# Altium schematic sheet I2C_Mux.SchDoc: I2C Mux
size A; DocumentNumber: 22; SheetNumber: 22; SheetTotal: 22
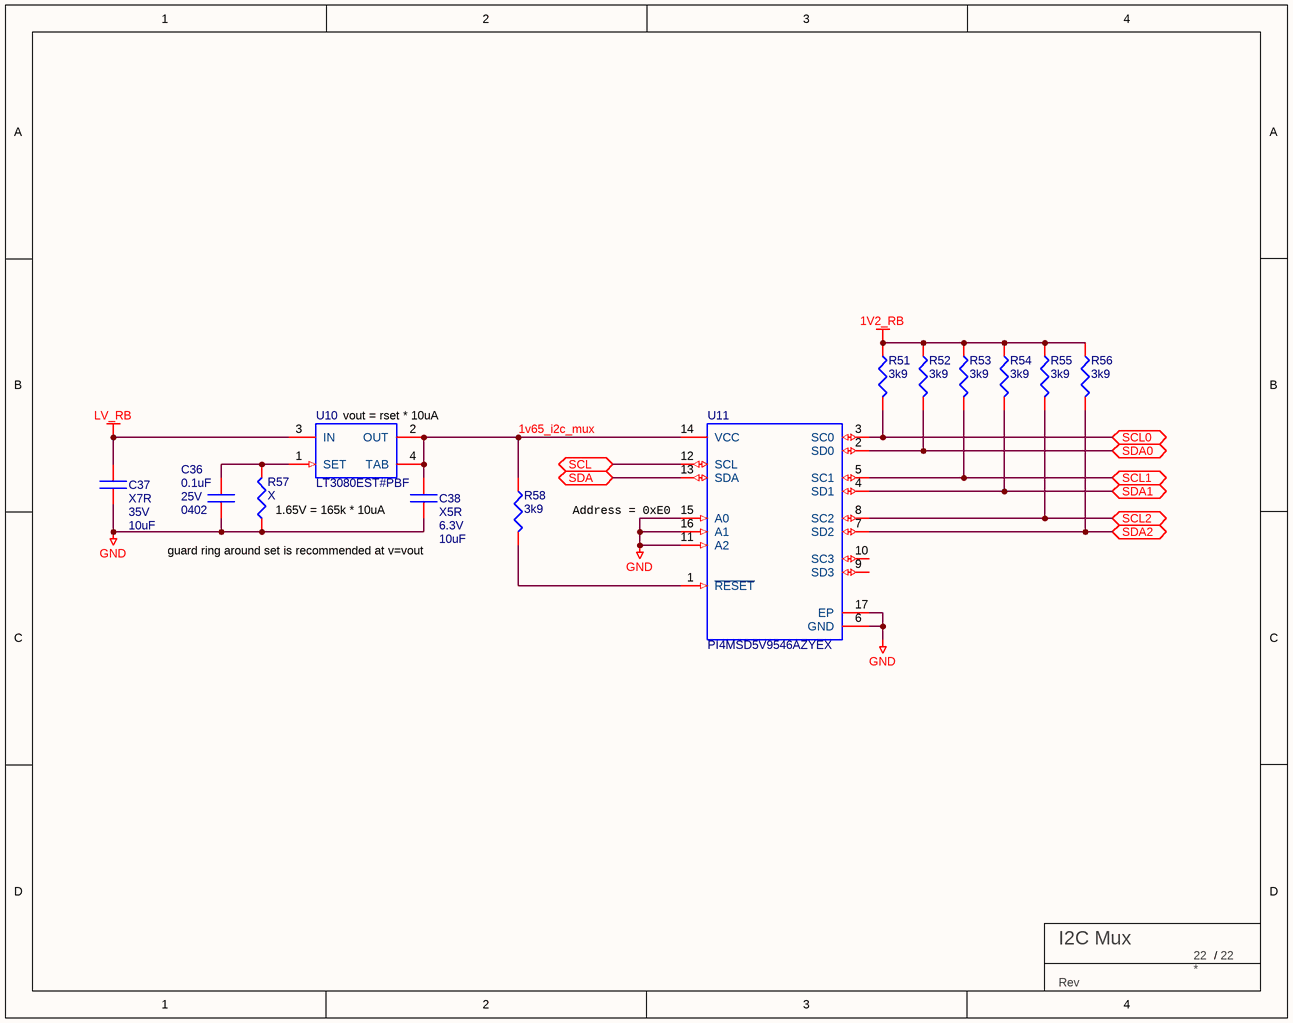
[diagram p0: I2C_Mux.SchDoc]

## Parts
C36  0.1uF  Voltage: 25V  Package: 0402  [C_0402_IPC_NOSILK]
C37  TempCo: X7R  Voltage: 35V  [C_1206_IPC]  (hidden comment: 10uF)
C38  TempCo: X5R  Voltage: 6.3V  [C_0603_IPC]  (hidden comment: 10uF)
R51  3k9  [R_0402_IPC]
R52  3k9  [R_0402_IPC]
R53  3k9  [R_0402_IPC]
R54  3k9  [R_0402_IPC]
R55  3k9  [R_0402_IPC]
R56  3k9  [R_0402_IPC]
R57  Parameter 1: X  [resc1005n]  (hidden comment: ERJ-2GEJ201X)
R58  3k9  [R_0402_IPC]
TBLOCK?  BU Title block  (value not drawn)  (graphical)
U10  LT3080EST#PBF  [LT-ST-3-SOT-223_N]
U11  PI4MSD5V9546AZYEX  [FP-TQFN_ZY16_MSL1_PPF-MFG]

## Ports
SCL0 (bidir), SCL1 (bidir), SCL2 (bidir), SCL (bidir), SDA0 (bidir), SDA1 (bidir), SDA2 (bidir), SDA (bidir)

## Nets
1V2_RB: R51.1 R52.1 R53.1 R54.1 R55.1 R56.1
GND: C36.2 C37.2 C38.2 R57.1 U11.6(GND) U11.11(A2) U11.15(A0) U11.16(A1) U11.17(EP)
LV_RB: C37.1 U10.3(IN)
1v65_i2c_mux: C38.1 R58.1 U10.2(OUT) U10.4(TAB) U11.14(VCC)
SCL: U11.12(SCL) ; port SCL
SCL0: R51.2 U11.3(SC0) ; port SCL0
SCL1: R53.2 U11.5(SC1) ; port SCL1
SCL2: R55.2 U11.8(SC2) ; port SCL2
SDA: U11.13(SDA) ; port SDA
SDA0: R52.2 U11.2(SD0) ; port SDA0
SDA1: R54.2 U11.4(SD1) ; port SDA1
SDA2: R56.2 U11.7(SD2) ; port SDA2
NetC36_1: C36.1 R57.2 U10.1(SET)
NetR58_2: R58.2 U11.1(~{RESET})

Not connected (* = marked no-connect by the designer): U11 9(SD3) 10(SC3)

## Notes on the sheet
- (near U10) vout = rset * 10uA
- guard ring around set is recommended at v=vout
- (near R57) 1.65V = 165k * 10uA
- Address = 0xE0
- (in symbol TITLE_BLOCK_BU) /; Rev

## Library data of the parts
C36 = C-CER-E5-0.1uF-0402-25V-X7R: GRM155R71E104ME14D; TempCo: X7R
C37 = C-CER-E6-10uF-1206-35V-X7R: CAP CER 10UF 35V X7R 1206; Supplier 1: Digi-Key; VALUE: 10uF; Supplier Part Number 1: 587-3007-1-ND
C38 = C-CER-E6-10uF-0603-6.3V-X5R: CAP CER 10UF 6.3V X5R 0603; Supplier 1: Digi-Key; Supplier Part Number 1: 490-16349-1-ND; VALUE: 10uF
R51-R56 R58 = R-E3-3K9-0402-5%: RES SMD 3.9K OHM 5% 1/16W 0402
R57 = R1: FILM RESISTOR; Text Field2: 5%
TBLOCK? = TITLE_BLOCK_BU
U10 = LT3080EST#PBF: Adjustable 1.1 A Single Resistor Low Dropout Regulator, 0.3 mA Isupply, 3-pin SOT223 (ST-3), -40 to 125 degC, Pb-Free; Manufacturer: Linear Technology; Manufacturer 1: Analog Devices / Linear Technology; Initial Accuracy(%): 1; Vin Max(V): 36; Vin Min(V): 1.2; Extended Temp: E, I; Isupply(mA): 0.3; Mounting Technology: Surface Mount; DatasheetVersion: Rev. F; ComponentLink1URL: http://www.linear.com/; PartNumber: LT3080EST#PBF; ComponentLink2Description: Datasheet; ComponentLink3URL: http://cds.linear.com/docs/en/packaging/SOT_3_05-08-1630.pdf; PackageDescription: 3-Pin Plastic SOT-223, Body 3.505 x 6.505 mm, Pitch 2.3 mm; PackageVersion: Jun-10; ComponentLink2URL: http://cds.linear.com/docs/en/datasheet/3080fc.pdf; RoHS: TRUE; ComponentLink3Description: Package Specification; PackageReference: ST-3; ComponentLink1Description: Manufacturer URL; Manufacturer Part Number 1: LT3080EST#PBF
U11 = CMP-12731-000002-1: IC BUS SWITCH 1 X 4:1 16TQFN; On-State Resistance: 70R; Min Supply Voltage: 1.65V; Low Level Output Current: 6mA; Max Supply Voltage: 5.5V; Mount: Surface Mount; Packaging: Tape and Reel; Max Operating Temperature: 85°C; Min Operating Temperature: -40°C; RoHS Compliant: Yes